# Altium schematic sheet CarrierConnector.SchDoc
size A4; CompanyName: Technische Hochschule Nürnberg Georg Simon Ohm; Organization: UltraZohm; Address1: Kesslerplatz 12; Address2: 90489 Nürnberg; Address3: GERMANY; DocumentNumber: 3; SheetNumber: 3; SheetTotal: 12; Website: www.ultrazohm.com
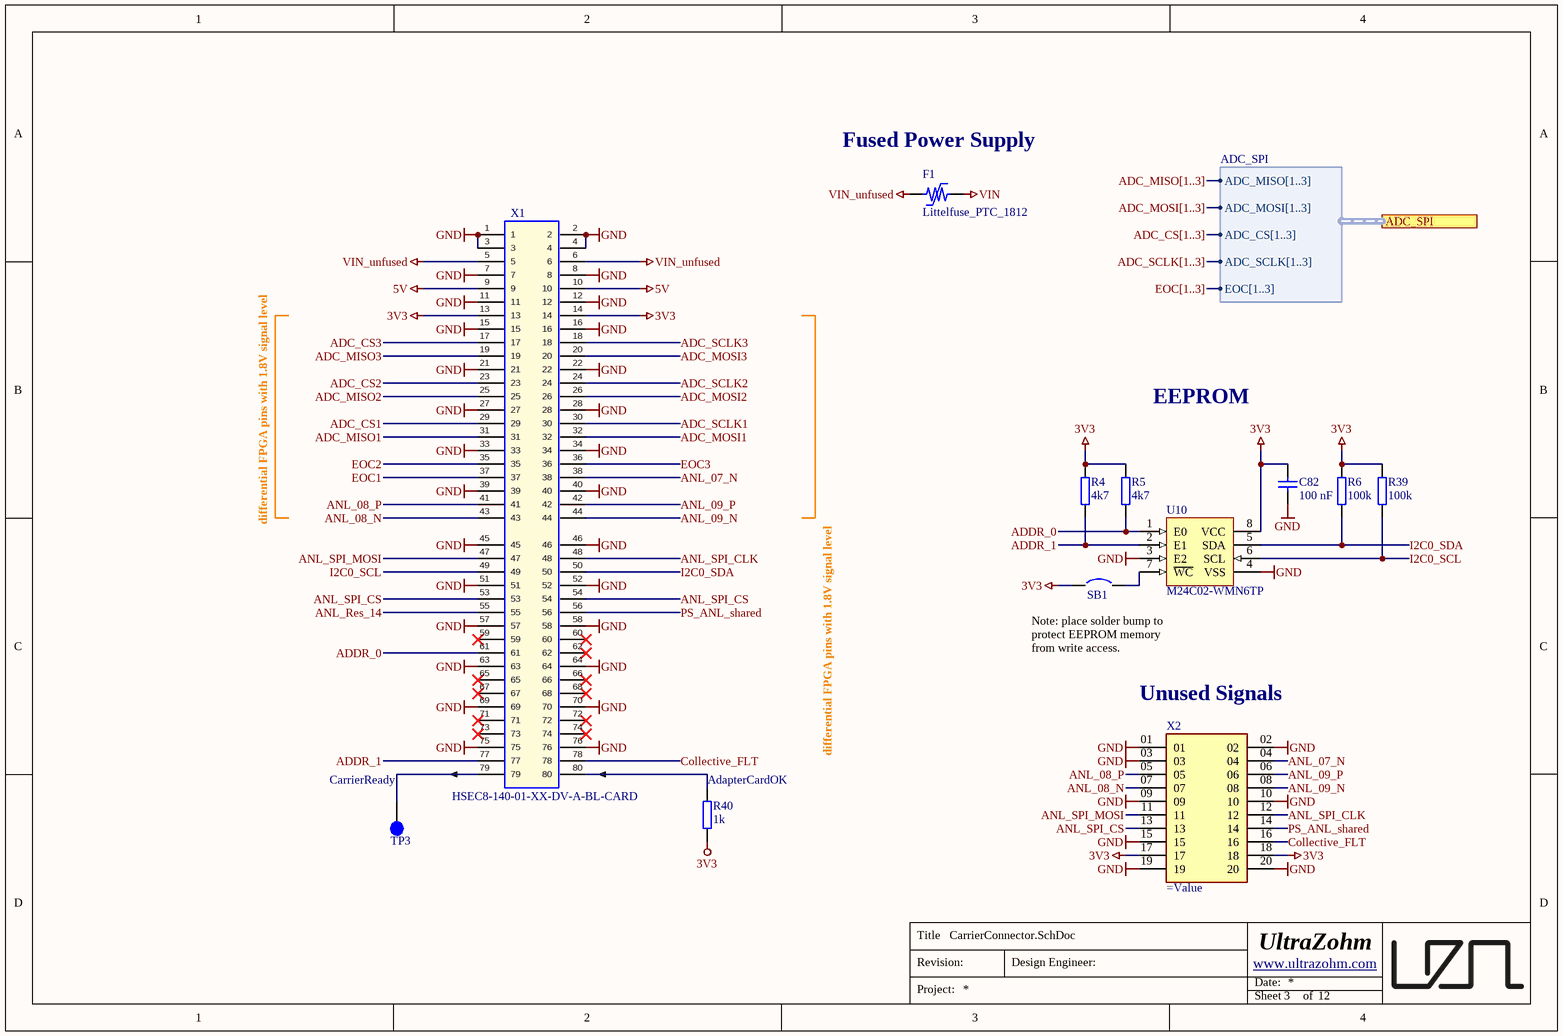
[diagram p0: CarrierConnector.SchDoc]

## Parts
C82  100 nF  [C_0603_TE]
F1  Littelfuse_PTC_1812  [1812_PTC_Polyfuse_Littelfuse]
R4  4k7  [R_0603_TE]
R5  4k7  [R_0603_TE]
R6  100k  [R_0603_TE]
R39  100k  [R_0603_TE]
R40  1k  [R_0603_TE]
SB1  Solder Bump 0603  [SB_0603]  (value not drawn)  (no BOM)
TP3  Testpoint 1mm  [TP_1mm]  (value not drawn)  (no BOM)
U10  M24C02-WMN6TP  [D0008A_N]
X1  HSEC8-140-01-XX-DV-A-BL-CARD  [HSEC8-140-01-XX-DV-A-BL-CARD]  (no BOM)
X2  (no value)  [SAMTEC_FTSH-110-X-X-DV]

## Ports
ADC_SPI (harness ADC_SPI)

## Harnesses
ADC_SPI: ADC_MISO[1..3], ADC_MOSI[1..3], ADC_CS[1..3], ADC_SCLK[1..3], EOC[1..3]

## Nets
3V3: C82.1 R4.2 R5.2 R6.2 R39.2 R40.1 SB1.1 U10.8(VCC) X1.13 X1.14 X2.17 X2.18
5V: X1.9 X1.10
GND: C82.2 U10.3(E2) U10.4(VSS) X1.1 X1.2 X1.3 X1.4 X1.7 X1.8 X1.11 X1.12 X1.15 X1.16 X1.21 X1.22 X1.27 X1.28 X1.33 X1.34 X1.39 X1.40 X1.45 X1.46 X1.51 X1.52 X1.57 X1.58 X1.63 X1.64 X1.69 X1.70 X1.75 X1.76 X2.01 X2.02 X2.03 X2.09 X2.10 X2.15 X2.19 X2.20
VIN: F1.2
VIN_unfused: F1.1 X1.5 X1.6
ADC_CS1: X1.29
ADC_CS2: X1.23
ADC_CS3: X1.17
ADC_MISO1: X1.31
ADC_MISO2: X1.25
ADC_MISO3: X1.19
ADC_MOSI1: X1.32
ADC_MOSI2: X1.26
ADC_MOSI3: X1.20
ADC_SCLK1: X1.30
ADC_SCLK2: X1.24
ADC_SCLK3: X1.18
ADDR_0: R5.1 U10.1(E0) X1.61
ADDR_1: R4.1 U10.2(E1) X1.77
ANL_07_N: X1.38 X2.04
ANL_08_N: X1.43 X2.07
ANL_08_P: X1.41 X2.05
ANL_09_N: X1.44 X2.08
ANL_09_P: X1.42 X2.06
ANL_Res_14: X1.55
ANL_SPI_CLK: X1.48 X2.12
ANL_SPI_CS: X1.53 X1.54 X2.13
ANL_SPI_MOSI: X1.47 X2.11
Collective_FLT: X1.78 X2.16
EOC1: X1.37
EOC2: X1.35
EOC3: X1.36
I2C0_SCL: R39.1 U10.6(SCL) X1.49
I2C0_SDA: R6.1 U10.5(SDA) X1.50
PS_ANL_shared: X1.56 X2.14
NetR40_2: R40.2 X1.80
NetSB1_2: SB1.2 U10.7(~{WC})
NetTP3_1: TP3.1 X1.79

Not connected (* = marked no-connect by the designer): X1 59* 60* 62* 65* 66* 67* 68* 71* 72* 73* 74*

## Buses and harness runs
bus ADC_CS[1..3]
bus ADC_MISO[1..3]
bus ADC_MOSI[1..3]
bus ADC_SCLK[1..3]
bus EOC[1..3]

## Notes on the sheet
- (near F1) Fused Power Supply
- EEPROM
- differential FPGA pins with 1.8V signal level
- Note: place solder bump to protect EEPROM memory from write access.
- (near X2) Unused Signals
- (near TP3) CarrierReady
- (near R40) AdapterCardOK
- Title
- Revision:
- Design Engineer:
- Date:
- Project:
- Sheet
- of

## Library data of the parts
C82 = UZgen_C_0603_100nF_50V_X7R: Generic capacitor; Manufacturer: UZgen; Tolerance: 10 %; Created from: AGeiger; Voltage: 50V; Manufacturer Part Number: UZgen_C_0603_100nF_50V_X7R; PartID: 1; Created On: 02.07.2024 14:42:23; Device Package: 0603; Last Updated: 08.08.2024 15:01:15; Mounting Type: SMD; Value: 100 nF; Technology: X7R
F1 = Littelfuse_PTC_1812: POLYSWITCH RESETTABLE DEVICES; MPN: miniASMDC110F/24; Value: PTC, 1.1 A, 24V; Voltage: 24V; Trip Current: 2.2A; Hold Current: 1.1A; Resistance: 0.18 Ohm; Type: Fuse; Nominal current: 1 A; Created from: MHlatky; MF: Littelfuse; Created: 2019_02_10_AGeiger; Package: 1812; ComponentLink1URL: https://www.littelfuse.com/~/media/electronics/datasheets/resettable_ptcs/littelfuse_ptc_surface_mount_catalog_datasheet.pdf.pdf; ComponentLink1Description: Datasheet; Manufacturer Part Number: Littelfuse_PTC_1812; PartID: 5; Created On: 07.05.2021 06:50:33; Component Type: Littelfuse_PTC_1812; Last Updated: 27.05.2022 15:06:17; Manufacturer: Littelfuse; Mounting Type: SMD; Operating Temperature: -40 - 85 °C; Supplier 1: Mouser; Supplier Part Number 1: 530-0ZCG0150BF2C; Live Cycle Status: 1; LCSC Part Number: C70119
R4 R5 = UZgen_R_0603_4k7: Generic resistor; Manufacturer: UZgen; Tolerance: 1 %; Created from: UZgenTool; Manufacturer Part Number: UZgen_R_0603_4k7; PartID: 237; Created On: 02.07.2024 17:29:50; Device Package: 0603; Last Updated: 02.07.2024 17:29:50; Mounting Type: SMD; Value: 4k7
R6 R39 = UZgen_R_0603_100k: Generic resistor; Manufacturer: UZgen; Tolerance: 1 %; Created from: UZgenTool; Manufacturer Part Number: UZgen_R_0603_100k; PartID: 268; Created On: 02.07.2024 17:29:50; Device Package: 0603; Last Updated: 02.07.2024 17:29:50; Mounting Type: SMD; Value: 100k
R40 = UZgen_R_0603_1k: Generic resistor; Manufacturer: UZgen; Tolerance: 1 %; Created from: UZgenTool; Manufacturer Part Number: UZgen_R_0603_1k; PartID: 221; Created On: 02.07.2024 17:29:49; Value: 1k; Device Package: 0603; Mounting Type: SMD; Last Updated: 02.07.2024 17:29:49
SB1 = =Value: Created from: AGeiger; Revision: July-2002: Re-released for DXP Platform.; PartID: 1; Created On: 09.01.2024 17:13:56; Component Type: Solder Bump; Device Package: 0603; Last Updated: 09.01.2024 17:13:56; Manufacturer Part Number: Solder Bump 0603; Mounting Type: SMD; Value: Solder Bump 0603
TP3 = Testpoint_1mm: Manufacturer: UltraZohm; Created from: AGeiger; Created: 2018_06_25_AGeiger; Value: Testpoint 1mm; Manufacturer Part Number: Testpoint_1mm; PartID: 9; Created On: 20.09.2022 13:14:57; Component Type: Testpoint; Last Updated: 14.08.2025 11:47:07; Supplier 1: NULL; Supplier Part Number 1: NULL; Type: Testpoint; Live Cycle Status: 1
U10 = M24C02-WMN6TP: 2Kbit I2C SOP-8 EEPROM ROHS; Manufacturer: STMicroelectronics; Created from: AGeiger; Manufacturer Part Number: M24C02-WMN6TP; PartID: 1; Created On: 19.11.2023 14:54:27; ComponentLink1Description: Datasheet; ComponentLink1URL: https://www.st.com/resource/en/datasheet/m24c01-w.pdf; Component Type: EEPROM; Device Package: SOIC-8; Last Updated: 19.11.2023 21:39:04; Mounting Type: SMD; Operating Temperature: -40 to +85 °C; Series: M24xxx; Supplier 1: Mouser; Supplier Part Number 1: 511-M24C02-WMN6TP; Supplier 2: LCSC; Supplier Part Number 2: C7562; Type: Memory; Value: M24C02-WMN6TP; LCSC Part Number: C7562; MF: STMicroelectronics; MPN: M24C02-WMN6TP
X1 = HSEC8-140-01-XX-DV-A-BL-CARD: Mating Card Layout for HSEC8-140-01-XX-DV-A-BL-CARD; Manufacturer: SAMTEC; Created from: MHlatky; Number of positions: 100; Created: 2018_04_23_AGeiger; Value: HSEC8-140-01-XX-DV-A-BL-CARD; Manufacturer Part Number: HSEC8-140-01-XX-DV-A-BL-CARD; PartID: 21; Created On: 26.02.2021 16:36:12; ComponentLink1Description: Homepage; ComponentLink1URL: https://www.samtec.com/products/hsec8-dp; Component Type: Board to Board Connector; Device Package: PCB Shape; Last Updated: 26.02.2021 16:37:20; Mounting Type: PCB Shape; Series: HSEC8; Supplier 1: SAMTEC; Supplier Part Number 1: NA; Type: Board to Board Connector; Live Cycle Status: 1; Stock number: not stored; Number of rows: 2
X2 = FTSH-110-01-L-DV: Headers & Wire Housings High Reliability Header Strips, 0.050 pitch; Manufacturer: SAMTEC; Created from: AGeiger; Price: None; Value: FTSH-110-01-L-DV; Availability: Unavailable; Package: None; MP: FTSH-110-X-X-DV; PartID: 1; Created On: 29.09.2022 16:58:28; ComponentLink1Description: Datasheet; ComponentLink1URL: https://eu.mouser.com/datasheet/2/527/ftsh_th-2854322.pdf; Last Updated: 29.09.2022 16:58:28; Manufacturer Part Number: FTSH-110-01-L-DV; Mounting Type: SMD; Operating Temperature: -55 °C to +125 °C; Series: FTSH; Supplier 1: Mouser; Supplier Part Number 1: 200-FTSH11001LDV